# EAGLE design breaking_bitcoin (EAGLE 8.2.2)

## Sheet 1 of 2
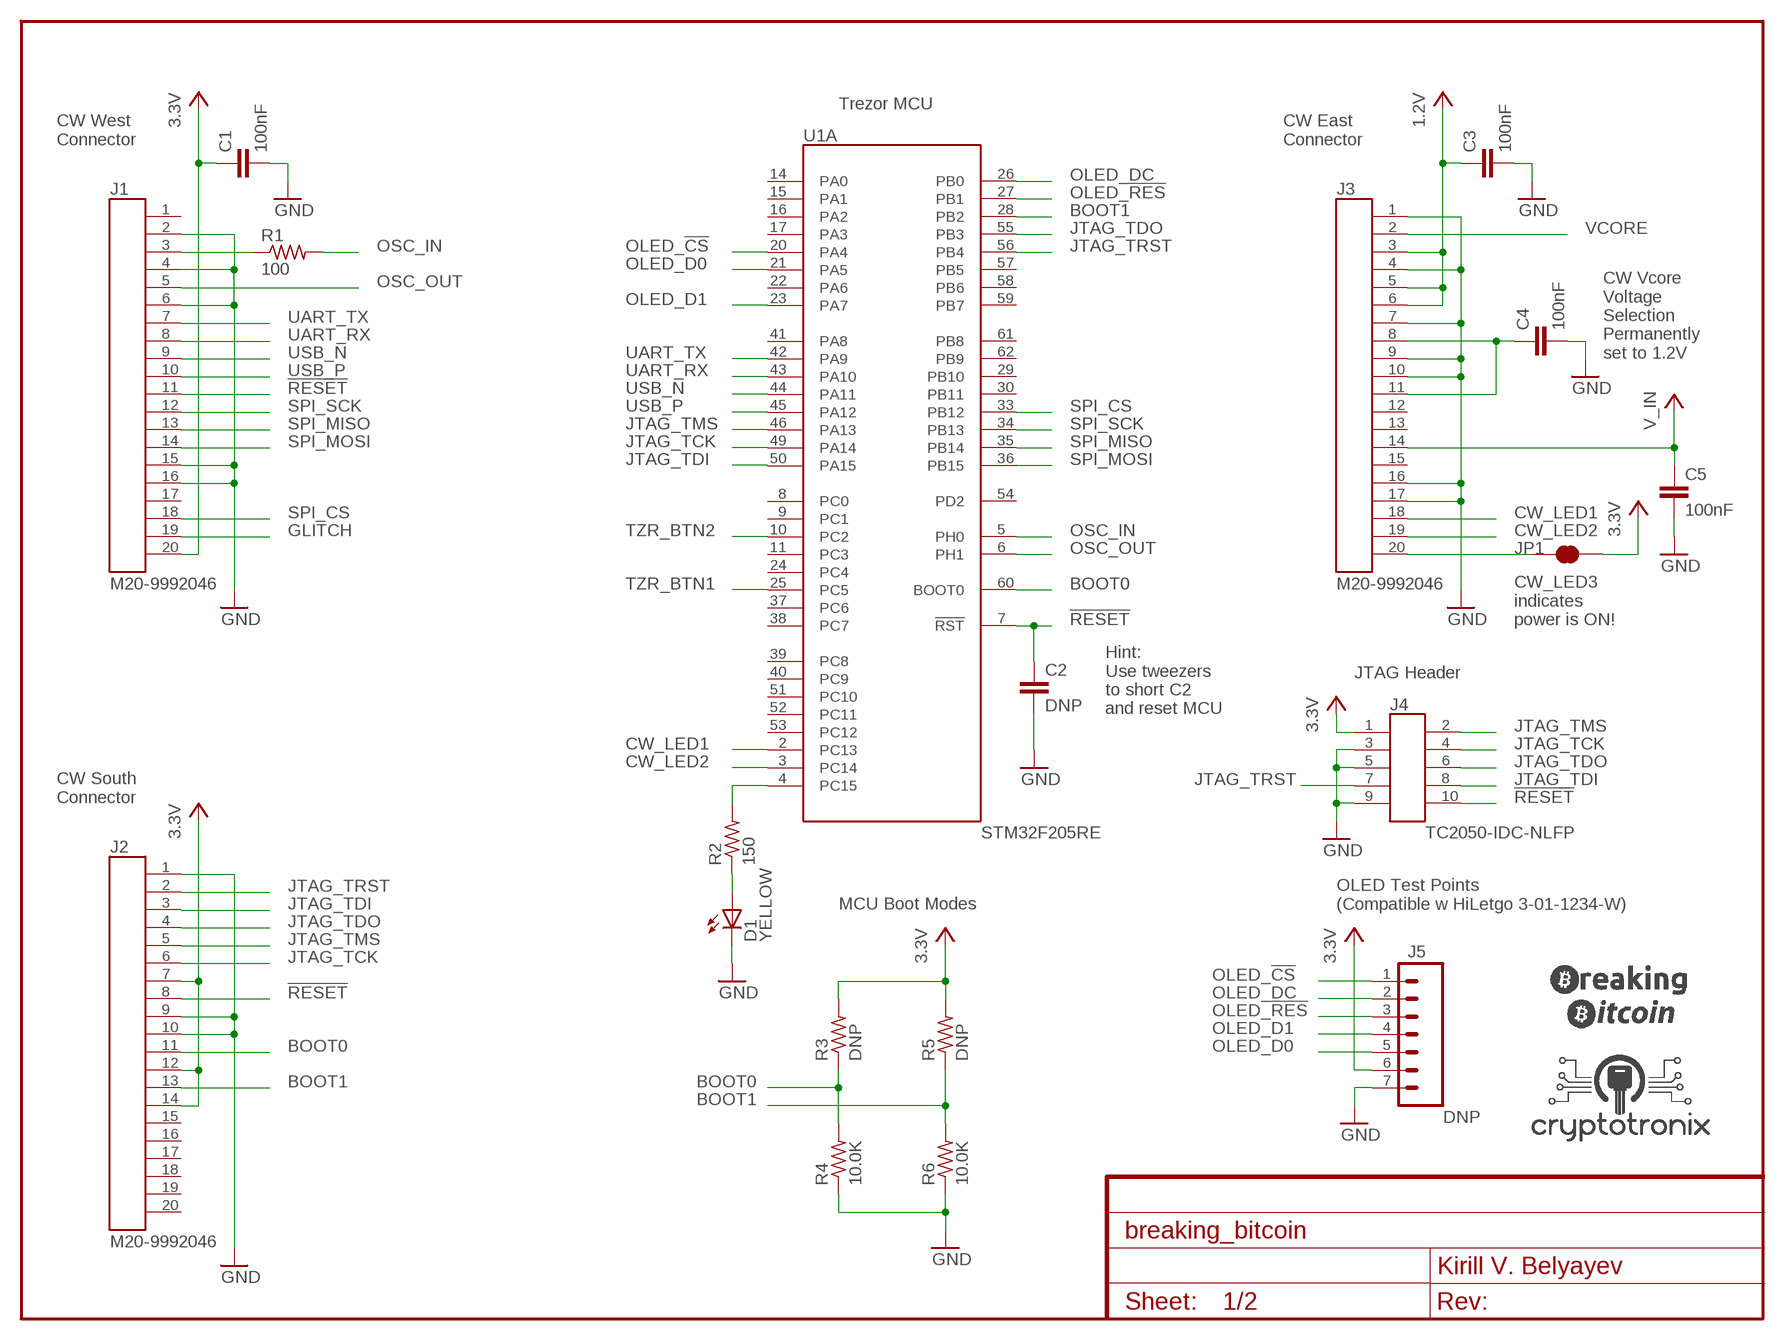
[diagram p0: schematic, sheet 1]
FRAME1 (FRAME-LETTER): CNAME: Breaking Bitcoin PCB; CREVISION: B; DESIGNER: Kirill V. Belyayev

### Parts
C1  100nF  C-EUC0603  [C0603]
C2  DNP  C-EUC0603  [C0603]
C3  100nF  C-EUC0603  [C0603]
C4  100nF  C-EUC0603  [C0603]
C5  100nF  C-EUC0603  [C0603]
D1  YELLOW  LTST-C190YKT  [0603]
J1  M20-9992046  [M20-9992046]
J2  M20-9992046  [M20-9992046]
J3  M20-9992046  [M20-9992046]
J4  TC2050-IDC-NLFP  [TC2050-IDC-NLFP]
J5  DNP  M07  [1X07]
JP1  JUMPER-PAD-2-NC_BY_TRACE  [PAD-JUMPER-2-NC_BY_TRACE_YES_SILK]
R1  100  R-US_R0603  [R0603]
R2  150  R-US_R0603  [R0603]
R3  DNP  R-US_R0603  [R0603]
R4  10.0K  R-US_R0603  [R0603]
R5  DNP  R-US_R0603  [R0603]
R6  10.0K  R-US_R0603  [R0603]
U1  STM32F205RE  [LQFP64]
U$1  BB_LOGO  [BB_LOGO]
U$2  CRYPTOTRONIX_LOGO  [CRYPTOTRONIX_LOGO]

### Nets
0V: C1.2 C2.2 C3.2 C4.2 C5.2 D1.C J1.2 J1.4 J1.6 J1.15 J1.16 J2.1 J2.9 J2.10 J3.1 J3.4 J3.7 J3.9 J3.10 J3.16 J3.17 J4.3 J4.5 J4.9 J5.7 R4.1 R6.1 ; supply symbol labelled GND ; also sheet 2
1.2V: C3.1 J3.3 J3.5 J3.6 ; also sheet 2
3.3V: C1.1 J1.20 J2.7 J2.12 J2.14 J4.1 J5.6 JP1.2 R3.2 R5.2 ; also sheet 2
!RESET: C2.1 J1.11 J2.8 J4.10 U1.7(A:!RST)
BOOT0: J2.11 R3.1 R4.2 U1.60(A:BOOT0)
BOOT1: J2.13 R5.1 R6.2 U1.28(A:PB2)
CW_LED1: J3.18 U1.2(A:PC13)
CW_LED2: J3.19 U1.3(A:PC14)
GLITCH: J1.19 ; also sheet 2
JTAG_TCK: J2.6 J4.4 U1.49(A:PA14)
JTAG_TDI: J2.3 J4.8 U1.50(A:PA15)
JTAG_TDO: J2.4 J4.6 U1.55(A:PB3)
JTAG_TMS: J2.5 J4.2 U1.46(A:PA13)
JTAG_TRST: J2.2 J4.7 U1.56(A:PB4)
N$1: J1.3 R1.1
N$2: R2.2 U1.4(A:PC15)
N$5: C4.1 J3.8 J3.11
N$11: D1.A R2.1
N$12: J3.20 JP1.1
OLED_!CS: J5.1 U1.20(A:PA4) ; also sheet 2
OLED_!RES: J5.3 U1.27(A:PB1) ; also sheet 2
OLED_D0: J5.5 U1.21(A:PA5) ; also sheet 2
OLED_D1: J5.4 U1.23(A:PA7) ; also sheet 2
OLED_DC: J5.2 U1.26(A:PB0) ; also sheet 2
OSC_IN: R1.2 U1.5(A:PH0) ; also sheet 2
OSC_OUT: J1.5 U1.6(A:PH1) ; also sheet 2
SPI_CS: J1.18 U1.33(A:PB12)
SPI_MISO: J1.13 U1.35(A:PB14)
SPI_MOSI: J1.14 U1.36(A:PB15)
SPI_SCK: J1.12 U1.34(A:PB13)
TZR_BTN1: U1.25(A:PC5) ; also sheet 2
TZR_BTN2: U1.10(A:PC2) ; also sheet 2
UART_RX: J1.8 U1.43(A:PA10)
UART_TX: J1.7 U1.42(A:PA9) ; also sheet 2
USB_N: J1.9 U1.44(A:PA11) ; also sheet 2
USB_P: J1.10 U1.45(A:PA12) ; also sheet 2
V_IN: C5.1 J3.14 ; also sheet 2
VCORE: J3.2 ; also sheet 2
Unconnected: J1.1 J1.17 J2.15 J2.16 J2.17 J2.18 J2.19 J2.20 J3.12 J3.13 J3.15 U1.8(A:PC0) U1.9(A:PC1) U1.11(A:PC3) U1.14(A:PA0) U1.15(A:PA1) U1.16(A:PA2) U1.17(A:PA3) U1.22(A:PA6) U1.24(A:PC4) U1.29(A:PB10) U1.30(A:PB11) U1.37(A:PC6) U1.38(A:PC7) U1.39(A:PC8) U1.40(A:PC9) U1.41(A:PA8) U1.51(A:PC10) U1.52(A:PC11) U1.53(A:PC12) U1.54(A:PD2) U1.57(A:PB5) U1.58(A:PB6) U1.59(A:PB7) U1.61(A:PB8) U1.62(A:PB9)

### Notes on the sheet
- Trezor MCU
- CW West 
  Connector
- CW East
  Connector
- CW Vcore 
  Voltage 
  Selection
  Permanently 
  set to 1.2V
- CW_LED3 
  indicates 
  power is ON!
- JTAG Header
- Hint:
  Use tweezers 
  to short C2 
  and reset MCU
- CW South
  Connector
- MCU Boot Modes
- OLED Test Points
  (Compatible w HiLetgo 3-01-1234-W)

## Sheet 2 of 2
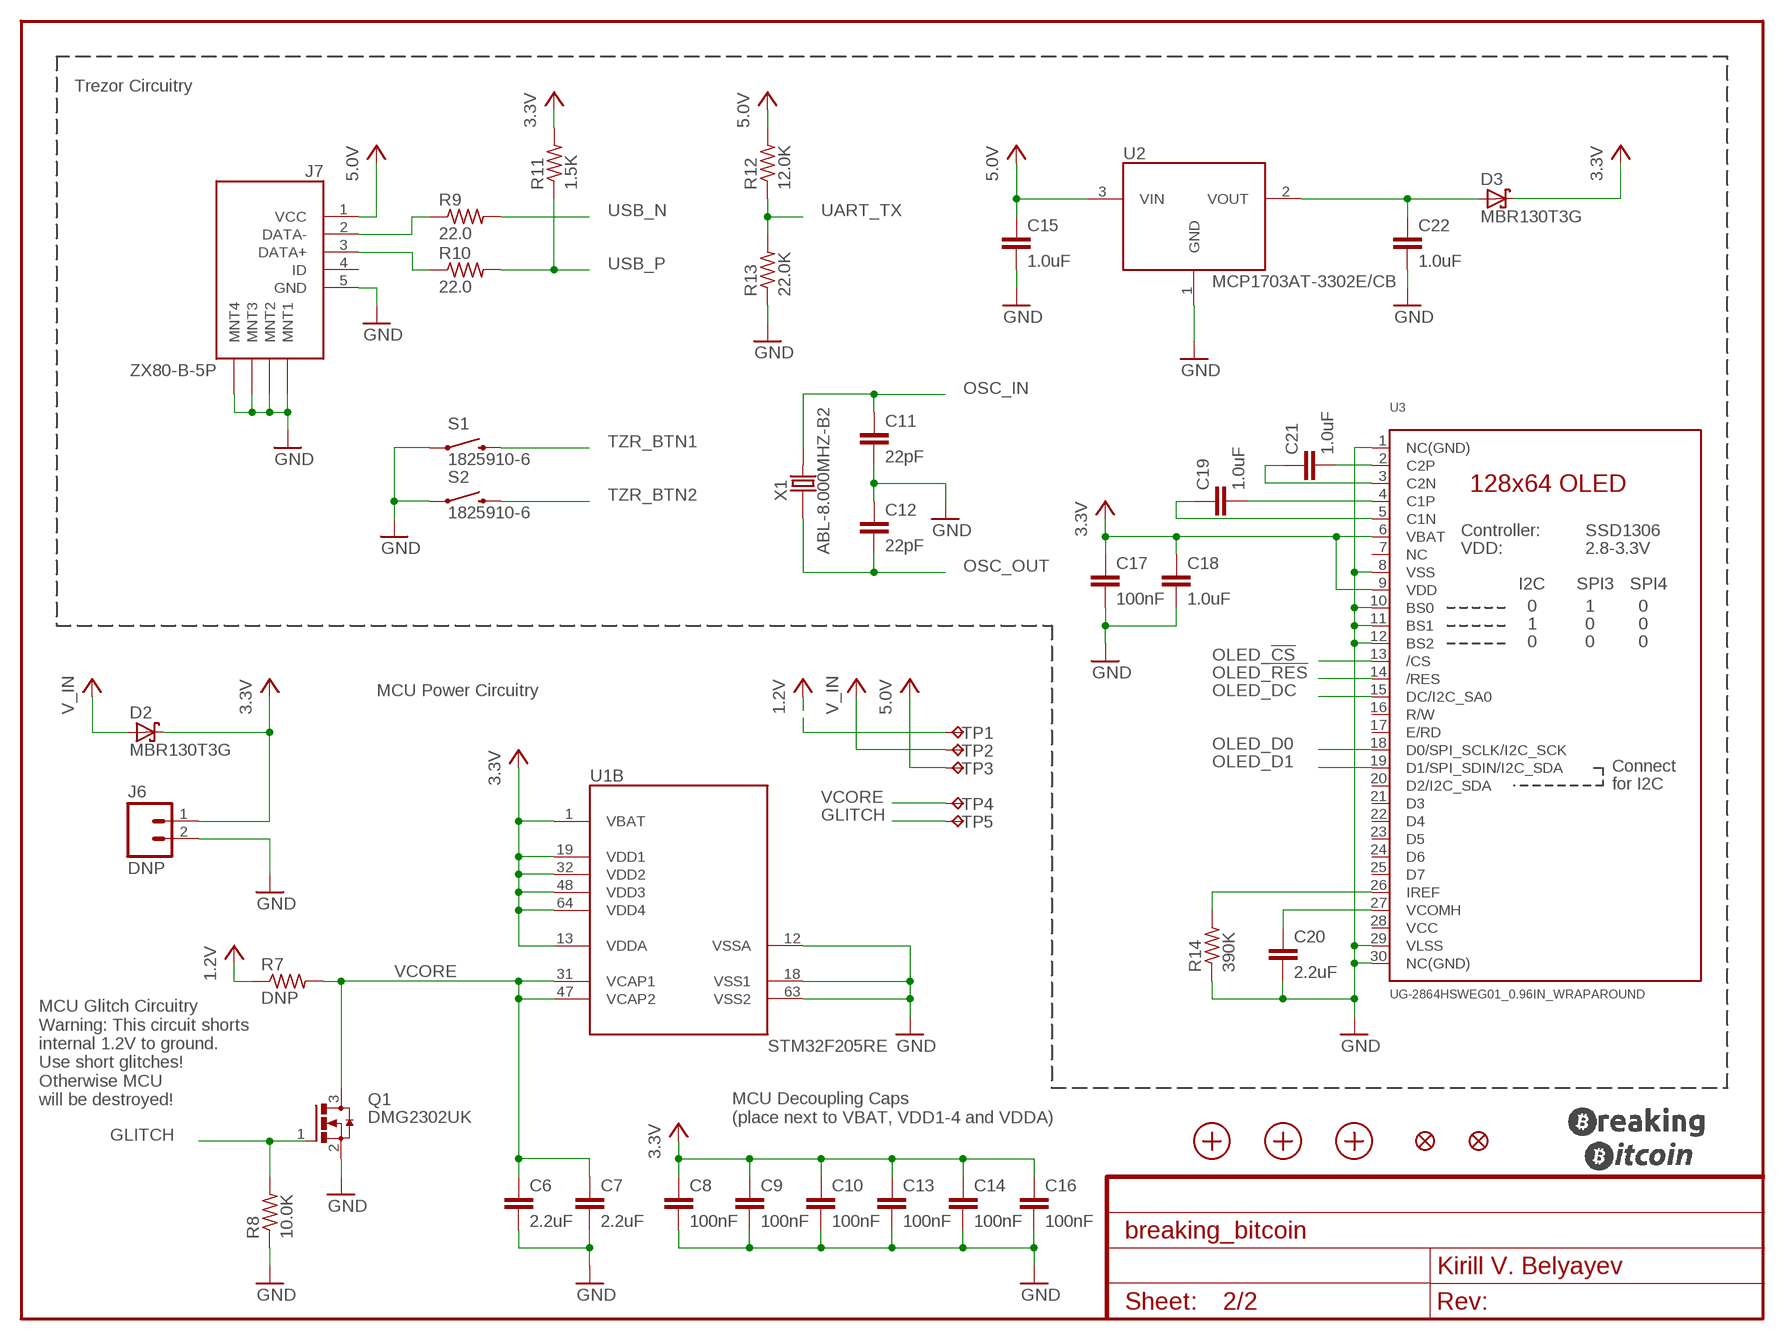
[diagram p1: schematic, sheet 2]
FRAME2 (FRAME-LETTER): CNAME: Breaking Bitcoin PCB; CREVISION: B; DESIGNER: Kirill V. Belyayev

### Parts
C6  2.2uF  C-EUC0603  [C0603]
C7  2.2uF  C-EUC0603  [C0603]
C8  100nF  C-EUC0603  [C0603]
C9  100nF  C-EUC0603  [C0603]
C10  100nF  C-EUC0603  [C0603]
C11  22pF  C-EUC0603  [C0603]
C12  22pF  C-EUC0603  [C0603]
C13  100nF  C-EUC0603  [C0603]
C14  100nF  C-EUC0603  [C0603]
C15  1.0uF  C-EUC0603  [C0603]
C16  100nF  C-EUC0603  [C0603]
C17  100nF  C-EUC0603  [C0603]
C18  1.0uF  C-EUC0603  [C0603]
C19  1.0uF  C-EUC0603  [C0603]
C20  2.2uF  C-EUC0603  [C0603]
C21  1.0uF  C-EUC0603  [C0603]
C22  1.0uF  C-EUC0603  [C0603]
D2  MBR130T3G  [SOD123]
D3  MBR130T3G  [SOD123]
FD1  FIDUCIALUFIDUCIAL  [MICRO-FIDUCIAL]
FD2  FIDUCIALUFIDUCIAL  [MICRO-FIDUCIAL]
J6  DNP  M20-9990246  [M20-9990246]
J7  ZX80-B-5P  [ZX80-B-5P]
MNT1  MOUNT-HOLE-NO-PLATE4-40  [MOUNT-HOLE-NO-PLATE-4-40]
MNT2  MOUNT-HOLE-NO-PLATE4-40  [MOUNT-HOLE-NO-PLATE-4-40]
MNT3  MOUNT-HOLE-NO-PLATE4-40  [MOUNT-HOLE-NO-PLATE-4-40]
Q1  DMG2302UK  [DMG2302UK]
R7  DNP  R-US_R0603  [R0603]
R8  10.0K  R-US_R0603  [R0603]
R9  22.0  R-US_R0603  [R0603]
R10  22.0  R-US_R0603  [R0603]
R11  1.5K  R-US_R0603  [R0603]
R12  12.0K  R-US_R0603  [R0603]
R13  22.0K  R-US_R0603  [R0603]
R14  390K  R-US_R0603  [R0603]
S1  1825910-6  SWITCH-TACT-TH  [SWITCH-TACT-TH]
S2  1825910-6  SWITCH-TACT-TH  [SWITCH-TACT-TH]
TP1  TEST-POINT40MIL  [TEST-POINT-40MILL]
TP2  TEST-POINT40MIL  [TEST-POINT-40MILL]
TP3  TEST-POINT40MIL  [TEST-POINT-40MILL]
TP4  TEST-POINT40MIL  [TEST-POINT-40MILL]
TP5  TEST-POINT40MIL  [TEST-POINT-40MILL]
U2  MCP1703AT-3302E/CB  [MCP1703AT-3302E/CB]
U3  UG-2864HSWEG01_0.96IN_WRAPAROUND  DISP_OLED_UG-2864HSWEG010.96"  [UG-2864HSWEG01_0.96IN_WRAPAROUND]
U$3  BB_LOGO  [BB_LOGO]
X1  ABL-8.000MHZ-B2  [ABL-8.000MHZ-B2]

### Nets
0V: C6.2 C7.2 C8.2 C9.2 C10.2 C11.2 C12.1 C13.2 C14.2 C15.2 C16.2 C17.2 C18.2 C20.2 C22.2 J6.2 J7.5(GND) J7.M1(MNT1) J7.M2(MNT2) J7.M3(MNT3) J7.M4(MNT4) Q1.2(S) R8.1 R13.1 R14.1 S1.1 S2.1 U1.12(B:VSSA) U1.18(B:VSS1) U1.63(B:VSS2) U2.1(GND) U3.1(NC(GND)) U3.8(VSS) U3.10(BS0) U3.11(BS1) U3.12(BS2) U3.29(VLSS) U3.30(NC(GND)) ; supply symbol labelled GND ; also sheet 1
1.2V: R7.1 TP1.1(PP) ; also sheet 1
3.3V: C8.1 C9.1 C10.1 C13.1 C14.1 C16.1 C17.1 C18.1 D2.C D3.C J6.1 R11.2 U1.1(B:VBAT) U1.13(B:VDDA) U1.19(B:VDD1) U1.32(B:VDD2) U1.48(B:VDD3) U1.64(B:VDD4) U3.6(VBAT) U3.9(VDD) ; also sheet 1
5.0V: C15.1 J7.1(VCC) R12.2 TP3.1(PP) U2.3(VIN)
GLITCH: Q1.1(G) R8.2 TP5.1(PP) ; also sheet 1
N$3: C19.1 U3.5(C1N)
N$4: C22.1 D3.A U2.2(VOUT)
N$6: C19.2 U3.4(C1P)
N$7: C21.2 U3.2(C2P)
N$8: J7.2(DATA-) R9.1
N$9: J7.3(DATA+) R10.1
N$10: C21.1 U3.3(C2N)
N$15: C20.1 U3.27(VCOMH)
N$16: R14.2 U3.26(IREF)
OLED_!CS: U3.13(/CS) ; also sheet 1
OLED_!RES: U3.14(/RES) ; also sheet 1
OLED_D0: U3.18(D0/SPI_SCLK/I2C_SCK) ; also sheet 1
OLED_D1: U3.19(D1/SPI_SDIN/I2C_SDA) ; also sheet 1
OLED_DC: U3.15(DC/I2C_SA0) ; also sheet 1
OSC_IN: C11.1 X1.2 ; also sheet 1
OSC_OUT: C12.2 X1.1 ; also sheet 1
TZR_BTN1: S1.3 ; also sheet 1
TZR_BTN2: S2.3 ; also sheet 1
UART_TX: R12.1 R13.2 ; also sheet 1
USB_N: R9.2 ; also sheet 1
USB_P: R10.2 R11.1 ; also sheet 1
V_IN: D2.A TP2.1(PP) ; also sheet 1
VCORE: C6.1 C7.1 Q1.3(D) R7.2 TP4.1(PP) U1.31(B:VCAP1) U1.47(B:VCAP2) ; also sheet 1
Unconnected: J7.4(ID) U3.7(NC) U3.16(R/W) U3.17(E/RD) U3.20(D2/I2C_SDA) U3.21(D3) U3.22(D4) U3.23(D5) U3.24(D6) U3.25(D7)

### Notes on the sheet
- Trezor Circuitry
- MCU Power Circuitry
- MCU Glitch Circuitry
  Warning: This circuit shorts
  internal 1.2V to ground.
  Use short glitches! 
  Otherwise MCU 
  will be destroyed!
- MCU Decoupling Caps
  (place next to VBAT, VDD1-4 and VDDA)

## Power pins joined to a net without a drawn wire
VCC: U3.28(VCC)

## Library data of the parts
C1-C10 C13 C14 C16 = rcl:C-EU: CAPACITOR, European symbol
C11 C12 C15 C17-C22 = rcl:C-EU: CAPACITOR, European symbol; NOTE: Trezor
D1 = KVB-diodes:LTST-C190: LED Indication Discrete 2.0V 10mA Test Current 0603 (1608 Metric); MAN-PART_NUM: LTST-C190; MANUFACTURER: Lite-On Inc.
D2 = KVB-diodes:MBR130T3G: Diode Schottky 30V 1A Surface Mount SOD-123; MAN-PART_NUM: MBR130T3G; MANUFACTURER: ON Semiconductor
D3 = KVB-diodes:MBR130T3G: Diode Schottky 30V 1A Surface Mount SOD-123; MAN-PART_NUM: MBR130T3G; MANUFACTURER: ON Semiconductor; NOTE: Trezor
FD1 FD2 = KVB-misc:FIDUCIAL: Fiducial Alignment Points Various fiducial points for machine vision alignment.
J1-J3 = KVB-connectors:M20-9992046: 20 Positions Header Cuttable Connector 0.100" (2.54mm) Through Hole Tin; MAN-PART_NUM: M20-9992046; MANUFACTURER: Harwin Inc.
J4 = KVB-connectors:TC2050-IDC-NLFP: JTAG Cable PLUG-OF-NAILS 10-PIN W/LEGS; MAN-PART_NUM: TC2050-IDC-NLFP; MANUFACTURER: Tag Connect
J5 = SparkFun-Connectors:M07: Header 7 Standard 7-pin 0.1" header. Use with straight break away headers (SKU : PRT-00116), right angle break away headers (PRT-00553), swiss pins (PRT-00743), machine pins (PRT-00117), and female headers (PRT-00115). NOTES ON THE VARIANTS LOCK and LOCK_LONGPADS... This footprint was designed to help hold the alignment of a through-hole component (i.e. 7-pin header) while soldering it into place. You may notice that each hole has been shifted either up or down by 0.005 of an inch from it's more standard position (which is usually a perfectly straight line). This slight alteration caused the pins (the squares in the middle) to touch the edges of the holes. Because they are alternating, it causes a "brace" to hold the header in place. 0.005 has proven to be the perfect amount of "off-center" position when using our standard breakaway headers. Although looks a little odd when you look at the bare footprint, once you have a header in there, the alteration is very hard to notice. Also, if you push a header all the way into place, it is covered up entirely on the bottom side. This idea of altering the position of holes to aid alignment will be further integrated into the Sparkfun Library for other footprints. It can help hold any component with 3 or more connection pins.
J6 = KVB-connectors:M20-9990246: 2 Positions Header Unshrouded Breakaway Connector 0.100" (2.54mm) Through Hole Tin; MAN-PART_NUM: M20-9990246; MANUFACTURER: Harwin Inc.
J7 = KVB-connectors:ZX80-B-5P: USB - micro B USB 2.0 Receptacle Connector 5 Position Surface Mount Through Hole; MAN-PART_NUM: ZX80-B-5P(30); MANUFACTURER: Hirose; NOTE: Trezor
JP1 = SparkFun-Passives:JUMPER-PAD-2-NC_BY_TRACE
MNT1-MNT3 = KVB-misc:MOUNT-HOLE-NO-PLATE: Various non plated mountain holes
Q1 = KVB-transistors:DMG2302UK: N-Channel MOSFET 20V 2.8A (Ta) 660mW (Ta) Surface Mount SOT-23; MAN-PART_NUM: DMG2302UK; MANUFACTURER: Diodes Inc.
R1-R8 = rcl:R-US_: RESISTOR, American symbol
R9-R14 = rcl:R-US_: RESISTOR, American symbol; NOTE: Trezor
S1 S2 = KVB-switches:SWITCH-TACT: Standard Tactile Switch SPST-NO Top Actuated; MAN-PART_NUM: 1825910-6; MANUFACTURER: TE Connectivity; NOTE: Trezor
TP1-TP5 = KVB-misc:TEST-POINT: Various Test Points
U1 = KVB-MCUs:STM32F205RE: ARM® Cortex®-M3 STM32 F2 Microcontroller IC 32-Bit 120MHz 512KB (512K x 8) FLASH 64-LQFP (10x10); MAN-PART_NUM: STM32F205RE; MANUFACTURER: STMicroelectronics
U2 = KVB-ICs:MCP1703AT-3302E/CB: Linear Voltage Regulator IC Positive Fixed Output 3.3V 250mA SOT-23A-3; MAN-PART_NUM: MCP1703AT-3302E/CB; MANUFACTURER: Microchip Technology; NOTE: Trezor
U3 = microbuilder:DISP_OLED_UG-2864HSWEG01: UG-2864HSWEG01 OLED display Both 1.3" and 0.96" models share the same FPC tab footprint, only the screen dimensions vary.; NOTE: Trezor
U$1 U$3 = KVB-misc:BB_LOGO: Breaking Bitcoin Logo
U$2 = KVB-misc:CRYPTOTRONIX_LOGO: Cryptotronix Logo
X1 = KVB-crystals:ABL-8.000MHZ-B2: 8MHz ±20ppm Crystal 18pF 80 Ohm -20°C ~ 70°C Through Hole HC49/US; MAN-PART_NUM: ABL-8.000MHZ-B2; MANUFACTURER: Abracon; NOTE: Trezor

## Board
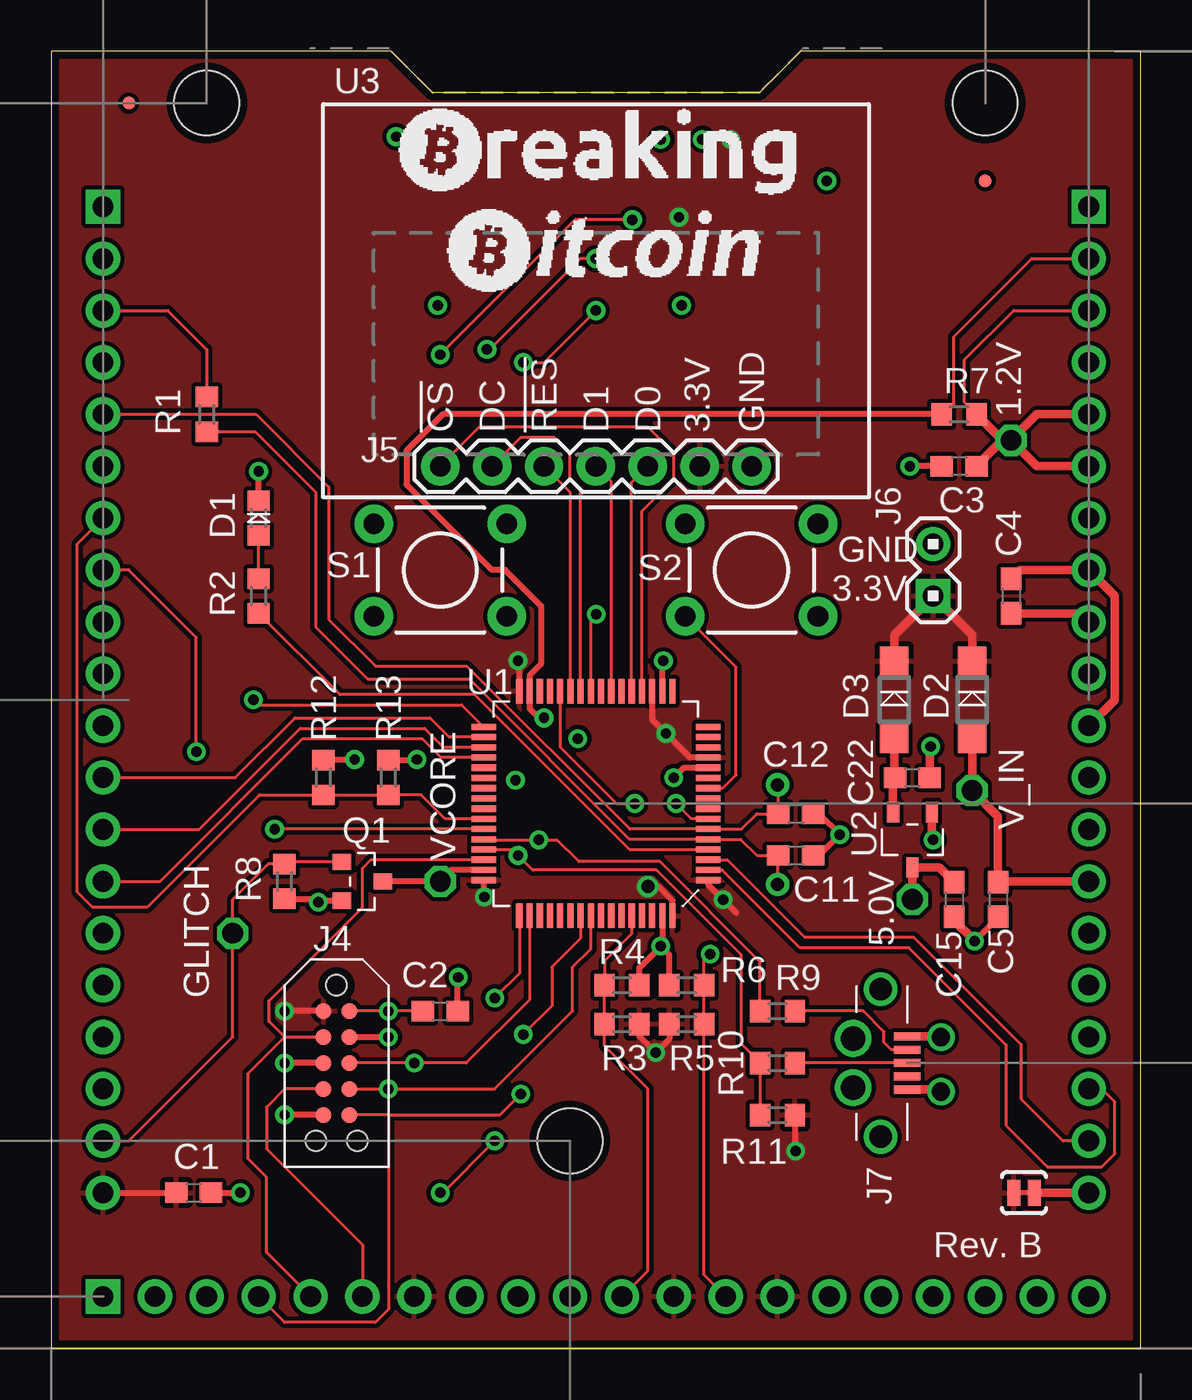
[diagram p2: board, top side]
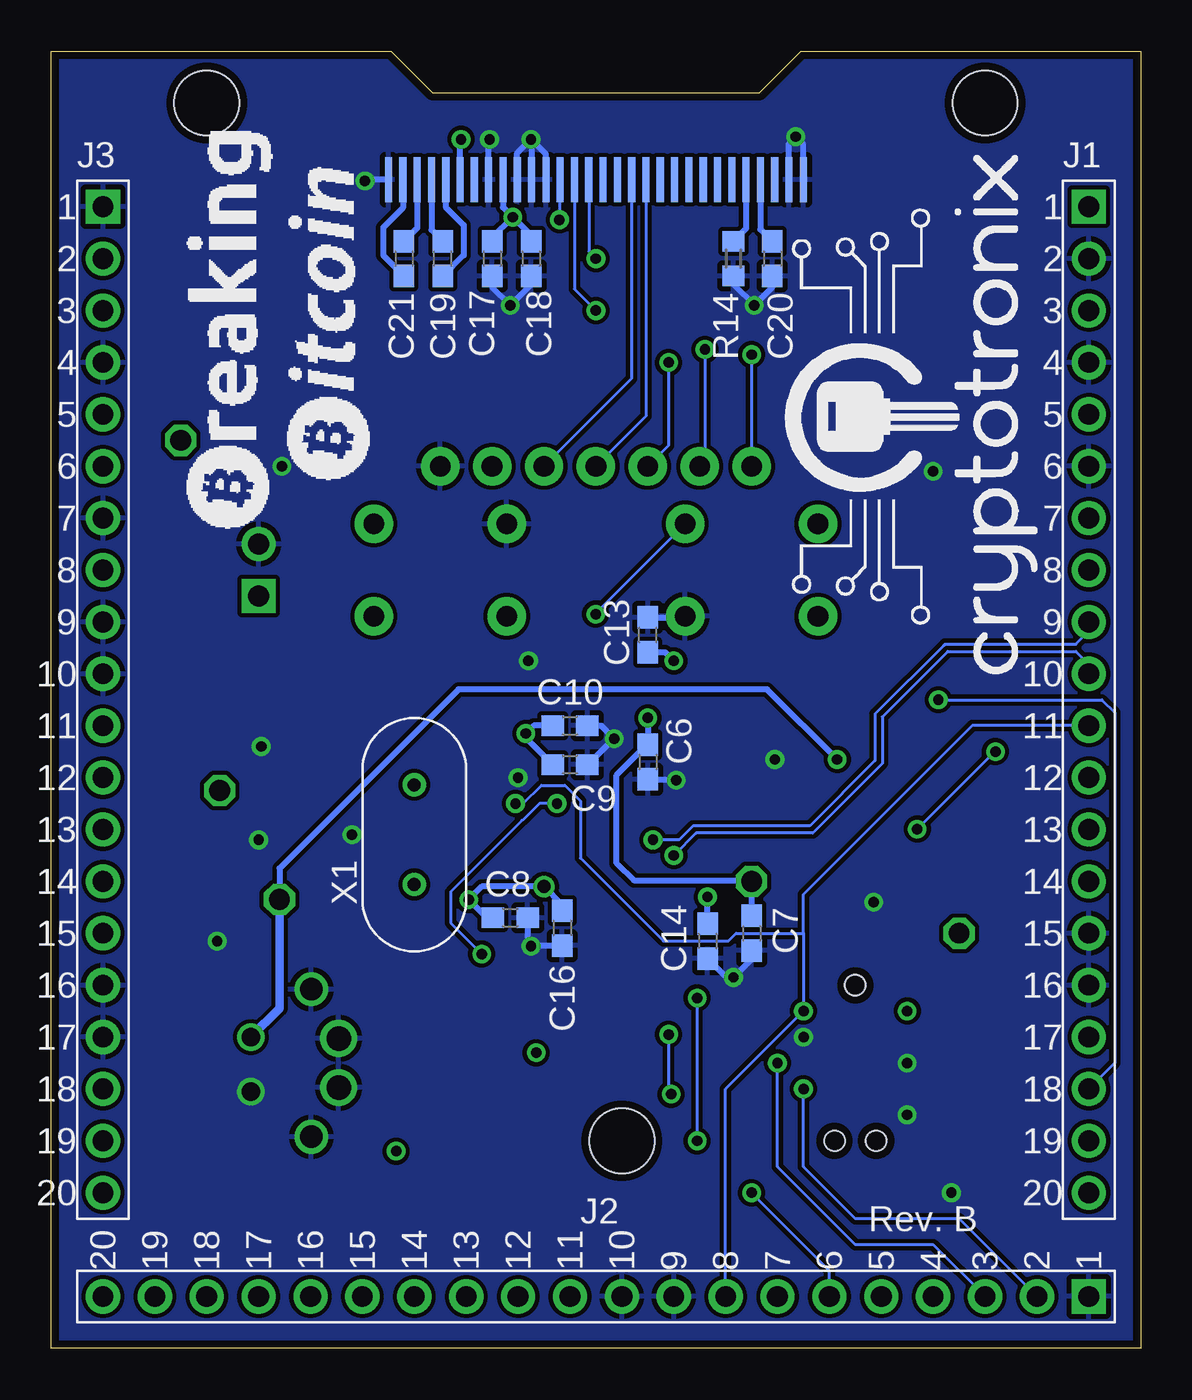
[diagram p3: board, bottom side, seen from below]

Size 53.34 x 63.5 mm. Coordinates in mm from the lower left corner, seen from the top.
Outline: 0,0 53.34,0 53.34,63.5 36.7,63.5 34.67,61.47 18.67,61.47 16.64,63.5 0,63.5 0,0
Copper layers (1*16): Top 0.035mm / dielectric 1.5mm / Bottom 0.035mm
Design rules "KVB-2layer *": minimum track width 6mil, minimum drill 15mil, track to track 8mil, track to pad 8mil, pad to pad 7mil, via to via 8mil, smd to smd 8mil, copper to edge 15mil, drill to drill 8mil, minimum pad ring 10mil, minimum via ring 8mil, stop-mask expansion 3mil, vias tented up to drill 0mil, thermal gap 10mil

### Footprints (pad centres in the part's own frame; a part is rotated, then mirrored left to right if it is on the bottom)
C0603 = smd 1.1 x 1: 1 -0.85,0; 2 0.85,0
0603 = smd 1.1 x 1: A 0,-0.85; C 0,0.85
SOD123 = smd 1.4 x 1.4: A 1.9,0; C -1.9,0
MICRO-FIDUCIAL = smd 0.635 x 0.635: 1 0,0
M20-9992046 = drill 1.016 pad 1.676 square: 1 -24.13,0 | drill 1.016 pad 1.676: 2 -21.59,0; 3 -19.05,0; 4 -16.51,0; 5 -13.97,0; 6 -11.43,0; 7 -8.89,0; 8 -6.35,0; 9 -3.81,0; 10 -1.27,0; 11 1.27,0; 12 3.81,0; 13 6.35,0; 14 8.89,0; 15 11.43,0; 16 13.97,0; 17 16.51,0; 18 19.05,0; 19 21.59,0; 20 24.13,0
TC2050-IDC-NLFP = smd 0.787 x 0.787: 1 -2.54,-0.635; 2 -1.27,-0.635; 3 0,-0.635; 4 1.27,-0.635; 5 2.54,-0.635; 6 2.54,0.635; 7 1.27,0.635; 8 0,0.635; 9 -1.27,0.635; 10 -2.54,0.635 | hole 1: -3.81,0; 3.81,-1.016; 3.81,1.016
1X07 = drill 1.016 pad 1.88: 1 0,0; 2 2.54,0; 3 5.08,0; 4 7.62,0; 5 10.16,0; 6 12.7,0; 7 15.24,0
M20-9990246 = drill 1.016 pad 1.676 square: 1 -1.27,0 | drill 1.016 pad 1.676: 2 1.27,0
ZX80-B-5P = smd 0.4 x 1.3: 1 -1.3,0; 2 -0.65,0; 3 0,0; 4 0.65,0; 5 1.3,0 | drill 1.1: M1 -3.61,-1.31; M4 3.61,-1.31 | drill 1.2: M2 -1.2,-2.65; M3 1.2,-2.65
PAD-JUMPER-2-NC_BY_TRACE_YES_SILK = smd 0.635 x 1.27: 1 -0.508,0; 2 0.508,0
MOUNT-HOLE-NO-PLATE-4-40 = hole 3.175: 0,0
DMG2302UK = smd 0.8 x 0.9: 1 -0.95,-1; 2 0.95,-1; 3 0,1
R0603 = smd 1 x 1.1: 1 -0.85,0; 2 0.85,0
SWITCH-TACT-TH = drill 1.016 pad 1.88: 1 -3.251,2.261; 2 3.251,2.261; 3 -3.251,-2.261; 4 3.251,-2.261
TEST-POINT-40MILL = drill 1.016 pad 1.524 octagon: 1 0,0
LQFP64 = smd 0.3 x 1.2: 1 -3.75,-5.5; 2 -3.25,-5.5; 3 -2.75,-5.5; 4 -2.25,-5.5; 5 -1.75,-5.5; 6 -1.25,-5.5; 7 -0.75,-5.5; 8 -0.25,-5.5; 9 0.25,-5.5; 10 0.75,-5.5; 11 1.25,-5.5; 12 1.75,-5.5; 13 2.25,-5.5; 14 2.75,-5.5; 15 3.25,-5.5; 16 3.75,-5.5; 33 3.75,5.5; 34 3.25,5.5; 35 2.75,5.5; 36 2.25,5.5; 37 1.75,5.5; 38 1.25,5.5; 39 0.75,5.5; 40 0.25,5.5; 41 -0.25,5.5; 42 -0.75,5.5; 43 -1.25,5.5; 44 -1.75,5.5; 45 -2.25,5.5; 46 -2.75,5.5; 47 -3.25,5.5; 48 -3.75,5.5 | smd 1.2 x 0.3: 17 5.5,-3.75; 18 5.5,-3.25; 19 5.5,-2.75; 20 5.5,-2.25; 21 5.5,-1.75; 22 5.5,-1.25; 23 5.5,-0.75; 24 5.5,-0.25; 25 5.5,0.25; 26 5.5,0.75; 27 5.5,1.25; 28 5.5,1.75; 29 5.5,2.25; 30 5.5,2.75; 31 5.5,3.25; 32 5.5,3.75; 49 -5.5,3.75; 50 -5.5,3.25; 51 -5.5,2.75; 52 -5.5,2.25; 53 -5.5,1.75; 54 -5.5,1.25; 55 -5.5,0.75; 56 -5.5,0.25; 57 -5.5,-0.25; 58 -5.5,-0.75; 59 -5.5,-1.25; 60 -5.5,-1.75; 61 -5.5,-2.25; 62 -5.5,-2.75; 63 -5.5,-3.25; 64 -5.5,-3.75
MCP1703AT-3302E/CB = smd 0.6 x 1: 1 -0.95,-1.35; 2 0.95,-1.35; 3 0,1.35
UG-2864HSWEG01_0.96IN_WRAPAROUND = smd 0.35 x 2.2 bottom: 1 -10.15,-1.2; 2 -9.45,-1.2; 3 -8.75,-1.2; 4 -8.05,-1.2; 5 -7.35,-1.2; 6 -6.65,-1.2; 7 -5.95,-1.2; 8 -5.25,-1.2; 9 -4.55,-1.2; 10 -3.85,-1.2; 11 -3.15,-1.2; 12 -2.45,-1.2; 13 -1.75,-1.2; 14 -1.05,-1.2; 15 -0.35,-1.2; 16 0.35,-1.2; 17 1.05,-1.2; 18 1.75,-1.2; 19 2.45,-1.2; 20 3.15,-1.2; 21 3.85,-1.2; 22 4.55,-1.2; 23 5.25,-1.2; 24 5.95,-1.2; 25 6.65,-1.2; 26 7.35,-1.2; 27 8.05,-1.2; 28 8.75,-1.2; 29 9.45,-1.2; 30 10.15,-1.2
ABL-8.000MHZ-B2 = drill 0.635: 1 -2.438,0; 2 2.438,0

### Placement (x,y rotation side)
C1  6.99,7.62 0 top
C2  19.05,16.51 0 top
C3  44.45,43.18 180 top
C4  46.99,36.83 270 top
C5  46.35,21.97 270 top
C6  24.13,28.7 270 bottom
C7  19.05,20.32 270 bottom
C8  30.86,21.08 0 bottom
C9  27.94,28.57 0 bottom
C10  27.94,30.48 0 bottom
C11  36.45,24.13 0 top
C12  36.45,26.16 180 top
C13  24.13,34.92 90 bottom
C14  21.21,19.94 270 bottom
C15  44.2,21.97 270 top
C16  28.32,20.57 270 bottom
C17  31.75,53.34 270 bottom
C18  29.84,53.34 270 bottom
C19  34.16,53.34 90 bottom
C20  18.03,53.34 270 bottom
C21  36.07,53.34 270 bottom
C22  42.16,27.94 0 top
D1  10.16,40.64 0 top
D2  45.09,31.75 270 top
D3  41.27,31.75 270 top
FD1  3.81,60.96 0 top
FD2  45.72,57.15 0 top
J1  2.54,31.75 270 bottom
J2  26.67,2.54 180 bottom
J3  50.8,31.75 270 bottom
J4  13.97,13.97 270 top
J5  19.05,43.18 0 top
J6  43.18,38.1 90 top
J7  41.91,13.97 270 top
JP1  47.62,7.62 180 top
MNT1  25.4,10.16 0 top
MNT2  45.72,60.96 0 top
MNT3  7.62,60.96 0 top
Q1  15.24,22.86 270 top
R1  7.62,45.72 270 top
R2  10.16,36.83 270 top
R3  27.94,15.88 0 top
R4  27.94,17.78 180 top
R5  31.11,15.88 180 top
R6  31.11,17.78 0 top
R7  44.45,45.72 180 top
R8  11.43,22.86 90 top
R9  35.56,16.51 180 top
R10  35.56,13.97 180 top
R11  35.56,11.43 0 top
R12  13.34,27.94 90 top
R13  16.51,27.94 270 top
R14  19.94,53.34 90 bottom
S1  19.05,38.1 180 top
S2  34.29,38.1 0 top
TP1  46.99,44.45 0 top
TP2  45.09,27.3 0 top
TP3  42.16,21.97 0 top
TP4  19.05,22.86 0 top
TP5  8.89,20.32 0 top
U1  26.67,26.67 90 top
U2  42.16,24.89 180 top
U3  26.67,56.01 180 top
U$1  16.89,50.8 0 top
U$2  5.08,33.02 90 bottom
U$3  36.83,40.01 90 bottom
X1  35.56,25.15 270 bottom

### Tracks (layer width: path | path; a pad name or v marks a point on that pad's centre or on a via)
0V  (via drill 0.51, 0.89)
  Top 0.292: U1.18 29.92,33.6 v29.97,33.66 | U1.63 29.92,19.76 | U1.12 30.96,28.42 v30.48,27.94
  Top 0.305: v29.84,19.68 29.92,19.76 | R4.1 28.79,18.63 v29.84,19.68 | R6.1 30.27,19.27 v29.84,19.68 | Q1.2 13.15,21.91 arc90 v13.08,21.84 arc90 12.91,22.01 R8.1 | C3.2 v42.04,43.18 | C1.2 v9.27,7.62 | D1.C v10.16,42.93 | C11.2 37.59,24.13 v38.61,25.15 37.59,26.16 C12.1 | R13.1 17.87,28.79 v17.91,28.83 | C15.2 44.2,20.95 | C5.2 46.35,21.08 v45.21,19.94 | C2.2 19.9,18.12 v19.94,18.16 | J4.9 v16.51,15.24 | J4.3 v11.43,13.97 | J4.5 v11.43,11.43
  Top 0.406: C4.2 50.38,35.98 J3.9 | v45.21,19.94 44.2,20.95 | U2.1 43.11,24.96 v43.18,24.89 | C22.2 43.01,29.43 v43.05,29.46 | J7.5 43.59,12.67 v43.56,12.57
  Bottom 0.305: 26.8,28.57 C9.2 27.05,28.57 v25.78,29.84 26.42,30.48 C10.2 | C6.2 22.77,27.85 v22.73,27.81 | C13.2 22.37,35.77 S1.1 | C17.2 31.75,51.94 v30.86,51.05 29.84,52.07 C18.2 | C20.2 18.03,51.94 v18.92,51.05 19.94,52.07 R14.1 | U3.8 31.92,59.14 v31.88,59.18 | 29.82,59.16 U3.11 | 29.82,59.16 v29.84,59.18 30.52,58.51 U3.10 | U3.12 29.12,58.46 29.82,59.16 | U3.1 37.92,57.21 v37.97,57.15 | U3.29 17.22,58.98 v16.89,59.31 16.52,58.94 U3.30 | 29.81,19.72 C16.2 | 29.81,19.72 v29.84,19.68 | C8.2 30.01,19.93 29.81,19.72 | C14.2 20.28,18.16 v19.94,18.16 19.05,19.05 C7.2
  pour Bottom: -2.54,-2.54 55.88,-2.54 55.88,66.04 -2.54,66.04
1.2V
  Top 0.152: R7.1 44.7,46.32 44.7,48.39 47.12,50.8 J3.3
  Top 0.406: J3.6 48.26,43.18 TP1.1 | J3.5 48.26,45.72 TP1.1 | 46.57,44.45 C3.1 | TP1.1 46.57,44.45 | 46.57,44.45 R7.1
3.3V  (via drill 0.51, 0.64)
  Top 0.292: U1.19 29.42,30.78 | U1.32 22.92,33.59 | U1.13 31.28,28.92 v30.1,30.1 | U1.48 21.17,22.14 | U1.1 32.17,22.69 v32.89,21.97 | U1.64 30.42,21.91 29.73,22.61 v29.21,22.61
  Top 0.305: v30.1,30.1 29.42,30.78 | 22.92,33.59 v22.86,33.66 | J1.20 C1.1 | R3.2 28.79,15.28 v29.59,14.48 30.27,15.15 R5.2 | 21.17,22.14 v21.21,22.1 | R11.2 36.41,9.69 v36.45,9.65 | J4.1 v11.43,16.51 | v32.89,21.97 33.53,21.34
  Top 0.406: D2.C 45.09,34.92 J6.1 41.27,34.92 D3.C
  Bottom 0.305: C10.1 29.72,30.48 v30.1,30.1 30.06,30.06 30.06,29.84 C9.1 | U3.9 31.22,55.86 v30.73,55.37 | C18.1 29.84,54.48 v30.73,55.37 | C17.1 31.75,54.36 v30.73,55.37 | C13.1 23.28,34.08 v22.86,33.66 | U3.6 33.32,59.14 v33.27,59.18 | C14.1 v21.21,22.1 | C16.1 28.32,21.72 v29.21,22.61 32.26,22.61 v32.89,21.97 32,21.08 C8.1
  pour Top: -1.27,-1.27 54.61,-1.27 54.61,64.77 -1.27,64.77
5.0V  (via drill 0.51, 0.89)
  Top 0.305: 43.53,15.27 v43.56,15.24 | R12.2 13.37,28.83 v14.86,28.83
  Top 0.406: TP3.1 U2.3 43.48,23.54 C15.1 | J7.1 43.53,15.27
  Bottom 0.305: TP3.1 42.16,23.5 33.4,32.26 18.29,32.26 v14.86,28.83
  Bottom 0.406: v43.56,15.24 42.16,16.64 TP3.1
!RESET  (via drill 0.51)
  Top 0.152: U1.7 31.36,25.92 v30.61,26.67 | J4.10 v16.51,16.51 C2.1
  Bottom 0.152: v30.61,26.67 30.23,26.67 29.34,27.56 28.19,27.56 27.43,26.8 27.43,24 23.37,19.94 20.19,19.94 19.81,20.32 16.51,20.32 | J2.8 20.32,12.7 v16.51,16.51 16.51,20.32 | J1.11 8.26,30.48 16.51,22.23 16.51,20.32
BOOT0
  Top 0.152: U1.60 28.42,20.29 27.09,18.96 R4.2 R3.1 27.09,14.82 29.21,12.7 29.21,3.81 J2.11
  Top 0.203: 28.38,21.21 U1.60
BOOT1  (via drill 0.51)
  Top 0.152: J2.13 31.96,3.6 R5.1 R6.2 31.96,19.01 v32.26,19.3 | U1.28 24.92,29.44 27.69,26.67 v28.57,26.67
  Bottom 0.152: v28.57,26.67 29.44,26.67 30.27,25.84 30.29,25.84 33.78,22.35 33.78,20.83 v32.26,19.3
CW_LED1
  Top 0.152: U1.2 32.84,23.42 36.66,19.6 41.99,19.6 46.74,14.86 46.74,10.92 48.77,8.89 51.44,8.89 52.07,9.53 52.07,12.06 51.44,12.7 J3.18
CW_LED2
  Top 0.152: U1.3 33.1,23.92 36.9,20.13 42.23,20.13 47.5,14.86 47.5,12.19 49.53,10.16 J3.19
GLITCH
  Top 0.152: Q1.1 11.53,23.81 arc90 R8.2 10.63,23.71 8.89,21.97 TP5.1 8.89,15.24 3.81,10.16 J1.19
JTAG_TCK  (via drill 0.51)
  Top 0.152: J2.6 15.24,5.08 10.54,9.78 10.54,11.81 11.43,12.7 J4.4 | U1.49 22.92,18.35 v21.72,17.14 | v19.05,7.62 19.18,7.62 v21.72,10.16
  Bottom 0.152: v21.72,17.14 v21.72,10.16 | J2.6 15.24,3.81 v19.05,7.62
JTAG_TDI  (via drill 0.51)
  Top 0.152: J4.8 v17.79,13.97 20.32,13.97 23.42,17.07 U1.50
  Bottom 0.152: J2.3 10.16,5.08 13.97,5.08 17.78,8.89 v17.78,13.96 v17.79,13.97
JTAG_TDO  (via drill 0.51)
  Top 0.152: 16.51,11.43 16.51,3.17 | 16.51,3.17 16.51,3.05 | 16.51,11.43 J4.6 | 16.51,11.43 21.97,11.43 v22.99,12.45 | U1.55 25.92,20.08 24.51,18.67 24.51,16.76 v23.11,15.37 | 16.51,3.17 16.51,1.91 15.88,1.27 11.43,1.27 J2.4
  Bottom 0.152: v23.11,15.37 23.11,12.57 v22.99,12.45
JTAG_TMS
  Top 0.152: U1.46 15.67,23.93 15.24,23.5 15.24,21.59 10.67,17.02 10.67,16 11.43,15.24 | 11.43,15.24 J4.2 | J2.5 10.54,4.7 10.54,8.38 9.65,9.27 9.65,13.46 11.43,15.24
JTAG_TRST  (via drill 0.51)
  Top 0.152: J4.7 v16.51,12.7 21.72,12.7 25.53,16.51 25.53,18.67 26.42,19.56 U1.56
  Bottom 0.152: J2.2 8.89,6.35 13.97,6.35 16.51,8.89 v16.51,12.7
N$1
  Top 0.152: 7.62,46.99 R1.1 7.62,48.9 5.71,50.8 J1.3
N$2
  Top 0.152: U1.4 28.32,24.42 20.73,32 14.14,32 R2.2
N$3
  Bottom 0.305: U3.5 34.02,55.86 33.15,54.99 33.15,53.51 C19.1
N$4
  Top 0.305: 41.27,27.98 C22.1 arc90 41.21,27.84
  Top 0.406: 41.27,27.98 D3.A | 41.21,27.84 U2.2
N$5
  Top 0.406: C4.1 47.41,38.1 J3.8 52.07,36.83 52.07,31.75 J3.11
N$6
  Bottom 0.305: U3.4 34.72,54.75 C19.2
N$7
  Bottom 0.305: U3.2 36.12,55.83 37.08,54.86 37.08,53.51 C21.2
N$8
  Top 0.152: J7.2 41.13,14.62 40.77,14.99 40.77,15.49 39.75,16.51 R9.1
N$9
  Top 0.152: J7.3 R10.1
N$10
  Bottom 0.305: U3.3 35.42,54.84 C21.1
N$11
  Top 0.152: R2.1 D1.A
N$12
  Top 0.406: JP1.1 J3.20
N$15
  Bottom 0.305: U3.27 18.62,54.78 C20.1
N$16
  Bottom 0.305: U3.26 19.32,54.81 R14.2
OLED_!CS  (via drill 0.51)
  Top 0.152: U1.20 28.92,40.98 30.48,42.55 30.48,43.81 29.21,45.09 20.95,45.09 J5.1 | v28.46,55.24 25.65,55.24 v19.05,48.64
  Bottom 0.152: v19.05,48.64 J5.1 | U3.13 28.46,57.17 v28.46,55.24
OLED_!RES  (via drill 0.51)
  Top 0.152: U1.27 25.42,41.89 J5.3 | v23.11,48.26 24.13,48.26 v26.67,50.8
  Bottom 0.152: v23.11,48.26 23.11,44.2 J5.3 | U3.14 27.72,51.85 v26.67,50.8
OLED_D0
  Top 0.152: U1.21 28.42,42.39 J5.5
  Bottom 0.152: U3.18 24.92,47.47 J5.5
OLED_D1
  Top 0.152: U1.23 27.42,42.43 J5.4
  Bottom 0.152: U3.19 24.22,45.63 J5.4
OLED_DC  (via drill 0.51)
  Top 0.152: U1.26 25.92,42.02 25.4,42.55 25.4,43.81 24.64,44.58 22.99,44.58 J5.2 | v21.34,48.9 21.46,48.9 25.91,53.34 v26.67,53.34
  Top 0.203: 25.91,32.18 U1.26
  Bottom 0.152: v21.34,48.9 21.34,43.43 J5.2 | v26.67,53.34 27.02,53.69 U3.15
OSC_IN
  Top 0.152: X1.2 35.56,24.09 35.52,24.13 34.54,24.13 33.75,24.92 U1.5 | 32.14,24.95 U1.5 | U1.5 28.32,24.92 20.47,32.77 15.49,32.77 12.95,35.31 12.95,41.91 9.99,44.87 R1.2
  Top 0.203: 35.56,24.09 C11.1 | 32.14,24.95 32.12,24.96
OSC_OUT
  Top 0.152: X1.1 35.6,27.55 C12.2 34.54,26.16 33.8,25.42 U1.6 28.33,25.42 20.34,33.4 15.88,33.4 13.59,35.69 13.59,42.16 10.03,45.72 J1.5
SPI_CS  (via drill 0.51)
  Top 0.152: U1.33 20.09,31.5 10.16,31.5 v9.91,31.75
  Bottom 0.152: J1.18 1.27,13.97 1.27,31.11 1.91,31.75 v9.91,31.75
SPI_MISO
  Top 0.152: U1.35 19.22,29.42 18.29,30.35 12.19,30.35 7.24,25.4 J1.13
SPI_MOSI
  Top 0.152: U1.36 19.09,28.92 18.16,29.84 12.32,29.84 5.33,22.86 J1.14
SPI_SCK
  Top 0.152: U1.34 19.48,29.92 18.54,30.86 11.94,30.86 9.02,27.94 J1.12
TZR_BTN1  (via drill 0.51)
  Top 0.152: U1.25 26.42,35.68 v26.68,35.94
  Bottom 0.152: v26.68,35.94 26.68,35.98 S1.3
TZR_BTN2
  Top 0.152: U1.10 32.88,27.42 33.53,28.07 33.53,33.35 S2.3
UART_RX  (via drill 0.51)
  Top 0.152: U1.43 v10.94,25.42 | v7.11,29.21 7.11,34.8 3.81,38.1 J1.8
  Bottom 0.152: v10.94,25.42 7.15,29.21 v7.11,29.21
UART_TX
  Top 0.152: U1.42 19.29,25.92 18.12,27.09 R13.2 R12.1 10.2,27.09 4.7,21.59 2.03,21.59 1.27,22.35 1.27,39.37 J1.7
USB_N  (via drill 0.51)
  Top 0.152: R9.2 34.71,18.92 29.8,23.82 25.83,23.82 24.77,24.89 v23.88,24.89 21.2,24.89 U1.44
  Bottom 0.152: v23.88,24.89 22.6,24.89 21.91,25.58 16.2,25.58 13.01,28.78 13.01,31.06 9.65,34.42 9.6,34.47 3.17,34.47 2.54,35.1 J1.9
USB_P  (via drill 0.51)
  Top 0.152: R11.1 R10.2 33.78,14.9 33.78,19.27 29.63,23.42 23.57,23.42 v22.86,24.13 22.57,24.42 U1.45
  Bottom 0.152: v22.86,24.13 21.77,25.22 16.05,25.22 12.65,28.63 12.65,30.91 9.45,34.11 3.17,34.11 2.54,33.48 J1.10
V_IN
  Top 0.305: 46.39,22.86 C5.1
  Top 0.406: J3.14 46.39,22.86 | C5.1 46.35,26.04 TP2.1 D2.A
VCORE  (via drill 0.51)
  Top 0.152: 43.69,45.72 44.2,46.23 44.2,49.53 48.01,53.34 J3.2
  Top 0.203: 43.69,45.72 R7.2
  Top 0.292: U1.47 19.61,23.42 TP4.1 | 24,33.53 23.42,32.95 U1.31 23.42,31.32 23.88,30.86 v24.13,30.86
  Top 0.305: TP4.1 Q1.3 | 24,33.53 24,36.32 22.23,38.1 21.59,38.1 17.4,42.29 17.4,43.94 19.18,45.72 R7.2
  Bottom 0.305: C7.1 TP4.1 19.1,22.91 24.82,22.91 25.65,23.75 25.65,28.07 24.17,29.55 C6.1 v24.13,30.86

### Text on the board
tPlace: Rev. B
bPlace: Rev. B
tNames: 1.2V | !CS | DC | !RES | D1 | D0 | 3.3V | GND | GND | 3.3V | V_IN | VCORE | 5.0V | GLITCH